# EAGLE design Main PCB (EAGLE 9.6.2)
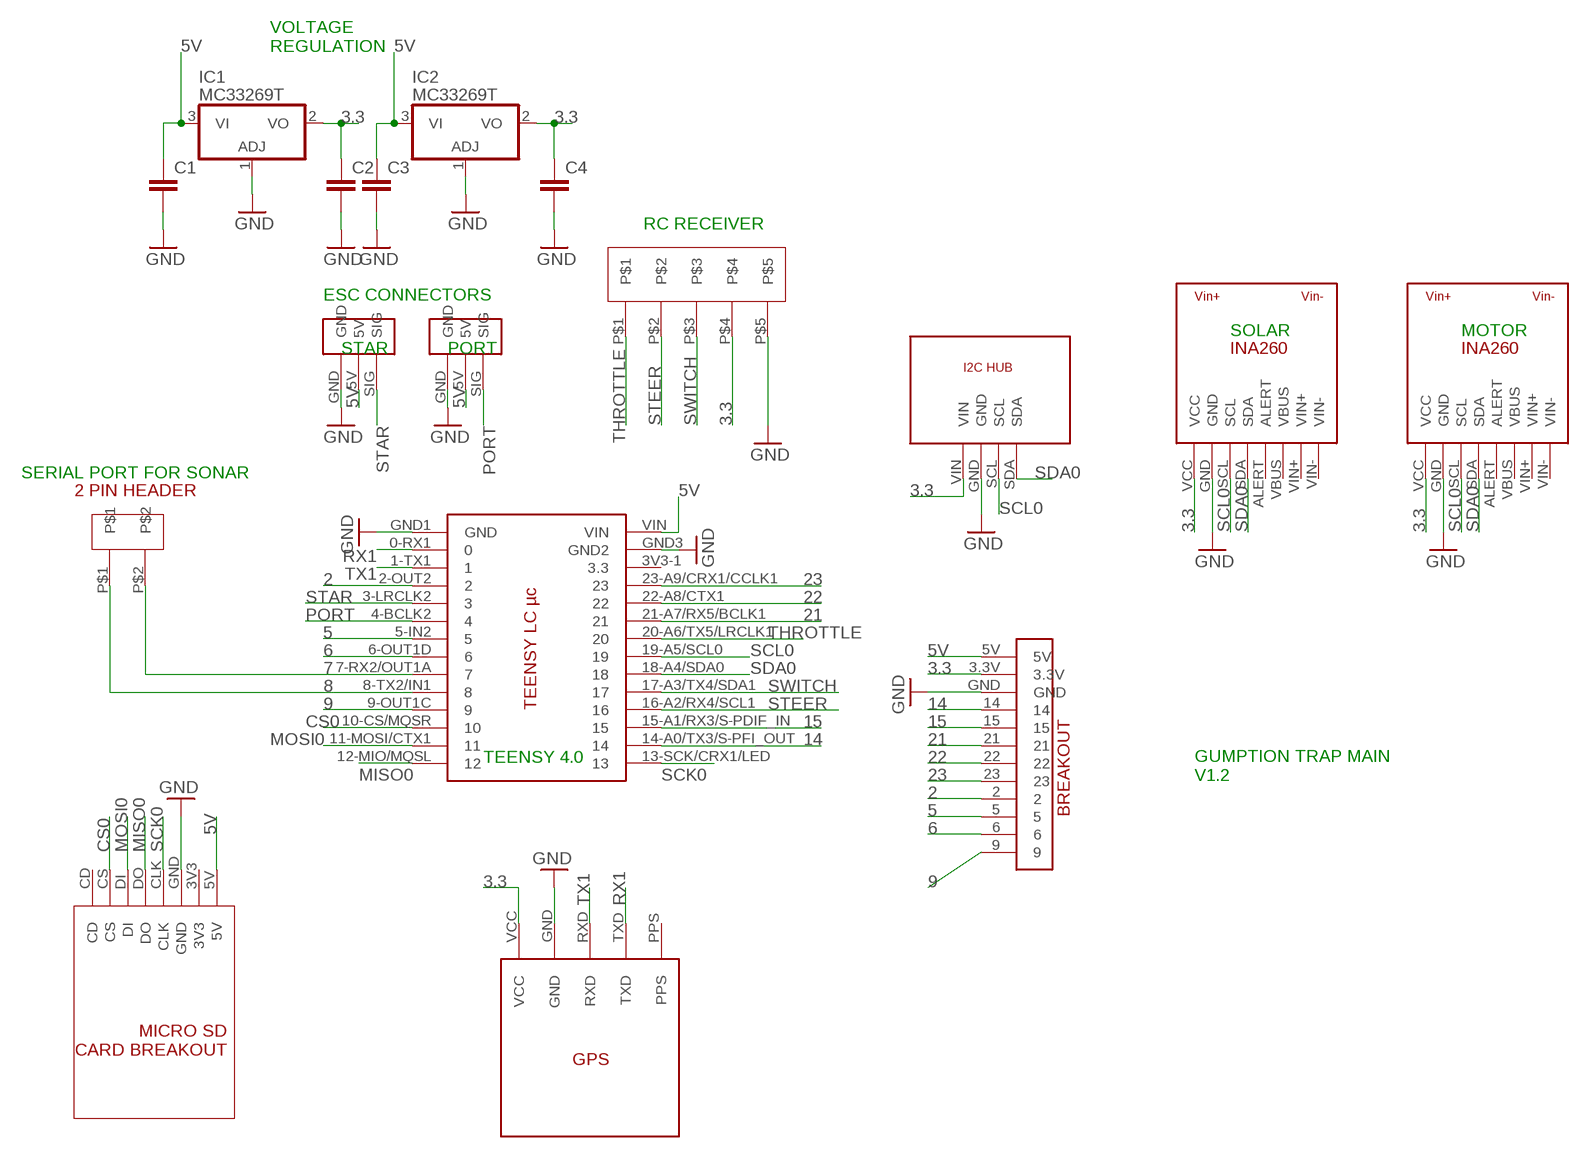
[diagram p0: schematic, sheet 1]

## Parts
C1  C2.5/2  [C2.5-2]
C2  C2.5/2  [C2.5-2]
C3  C2.5/2  [C2.5-2]
C4  C2.5/2  [C2.5-2]
IC1  MC33269T  [TO220V]
IC2  MC33269T  [TO220V]
MOTOR  INA260  [INA260]
PORT  SERVO3PIN  [SERVO3PIN]
SOLAR  INA260  [INA260]
STAR  SERVO3PIN  [SERVO3PIN]
U$1  TEENSYLC  [TEENSY40]
U$2  GPS  [GPS]
U$3  QT5HUB  [QT5HUB]
U$4  SD2  [SD2]
U$5  2PIN_JST-XH  [2PIN_JST-XH]
U$6  5PIN_JST-XH  [5PIN_JST-XH]
U$8  BREAKOUT  [BREAKOUT]

## Nets
2: U$1.2-OUT2 U$8.2
3.3: C2.1 C4.1 IC1.2(VO) IC2.2(VO) MOTOR.VCC SOLAR.VCC U$2.VCC U$3.VIN U$6.P$4 U$8.3.3V
5: U$1.5-IN2 U$8.5
5V: C1.1 C3.1 IC1.3(VI) IC2.3(VI) PORT.5V STAR.5V U$1.VIN U$4.5V U$8.5V
6: U$1.6-OUT1D U$8.6
7: U$1.7-RX2/OUT1A U$5.P$2
8: U$1.8-TX2/IN1 U$5.P$1
9: U$1.9-OUT1C U$8.9
14: U$1.14-A0/TX3/S-PFI_OUT U$8.14
15: U$1.15-A1/RX3/S-PDIF_IN U$8.15
21: U$1.21-A7/RX5/BCLK1 U$8.21
22: U$1.22-A8/CTX1 U$8.22
23: U$1.23-A9/CRX1/CCLK1 U$8.23
CS0: U$1.10-CS/MQSR U$4.CS
GND: C1.2 C2.2 C3.2 C4.2 IC1.1(ADJ) IC2.1(ADJ) MOTOR.GND PORT.GND SOLAR.GND STAR.GND U$1.GND1(GND) U$1.GND3(GND2) U$2.GND U$3.GND U$4.GND U$6.P$5 U$8.GND
MISO0: U$1.12-MIO/MQSL U$4.DO
MOSI0: U$1.11-MOSI/CTX1 U$4.DI
PORT: PORT.SIG U$1.4-BCLK2
RX1: U$1.0-RX1 U$2.TXD
SCK0: U$1.13-SCK/CRX1/LED U$4.CLK
SCL0: MOTOR.SCL SOLAR.SCL U$1.19-A5/SCL0 U$3.SCL
SDA0: MOTOR.SDA SOLAR.SDA U$1.18-A4/SDA0 U$3.SDA
STAR: STAR.SIG U$1.3-LRCLK2
STEER: U$1.16-A2/RX4/SCL1 U$6.P$2
SWITCH: U$1.17-A3/TX4/SDA1 U$6.P$3
THROTTLE: U$1.20-A6/TX5/LRCLK1 U$6.P$1
TX1: U$1.1-TX1 U$2.RXD
Unconnected: MOTOR.ALERT MOTOR.VBUS MOTOR.VIN+ MOTOR.VIN- SOLAR.ALERT SOLAR.VBUS SOLAR.VIN+ SOLAR.VIN- U$1.3V3-1(3.3) U$2.PPS U$4.3V3 U$4.CD

## Notes on the sheet
- VOLTAGE
  REGULATION
- RC RECEIVER
- ESC CONNECTORS
- SOLAR | MOTOR
- STAR | PORT
- SERIAL PORT FOR SONAR
- TEENSY 4.0
- GUMPTION TRAP MAIN
  V1.2

## Library data of the parts
C1-C4 = capacitor-wima:C: CAPACITOR naming: grid - package width
IC1 IC2 = linear:MC33269?*: Adjustable Output Low Dropout Voltage Regulator 800 mA Source: http://www.onsemi.com/pub/Collateral/MC33269-D.PDF
MOTOR SOLAR = GUMPTION TRAP:INA260
PORT STAR = GUMPTION TRAP:SERVO3PIN
U$1 = teensy:TEENSYLC
U$2 = HEXAPOD STUFF:GPS
U$3 = HEXAPOD STUFF:QT5HUB
U$4 = GUMPTION TRAP:SD2
U$5 = ROV:2PIN_JST-XH
U$6 = ROV:5PIN_JST-XH
U$8 = GUMPTION TRAP:BREAKOUT

## Board
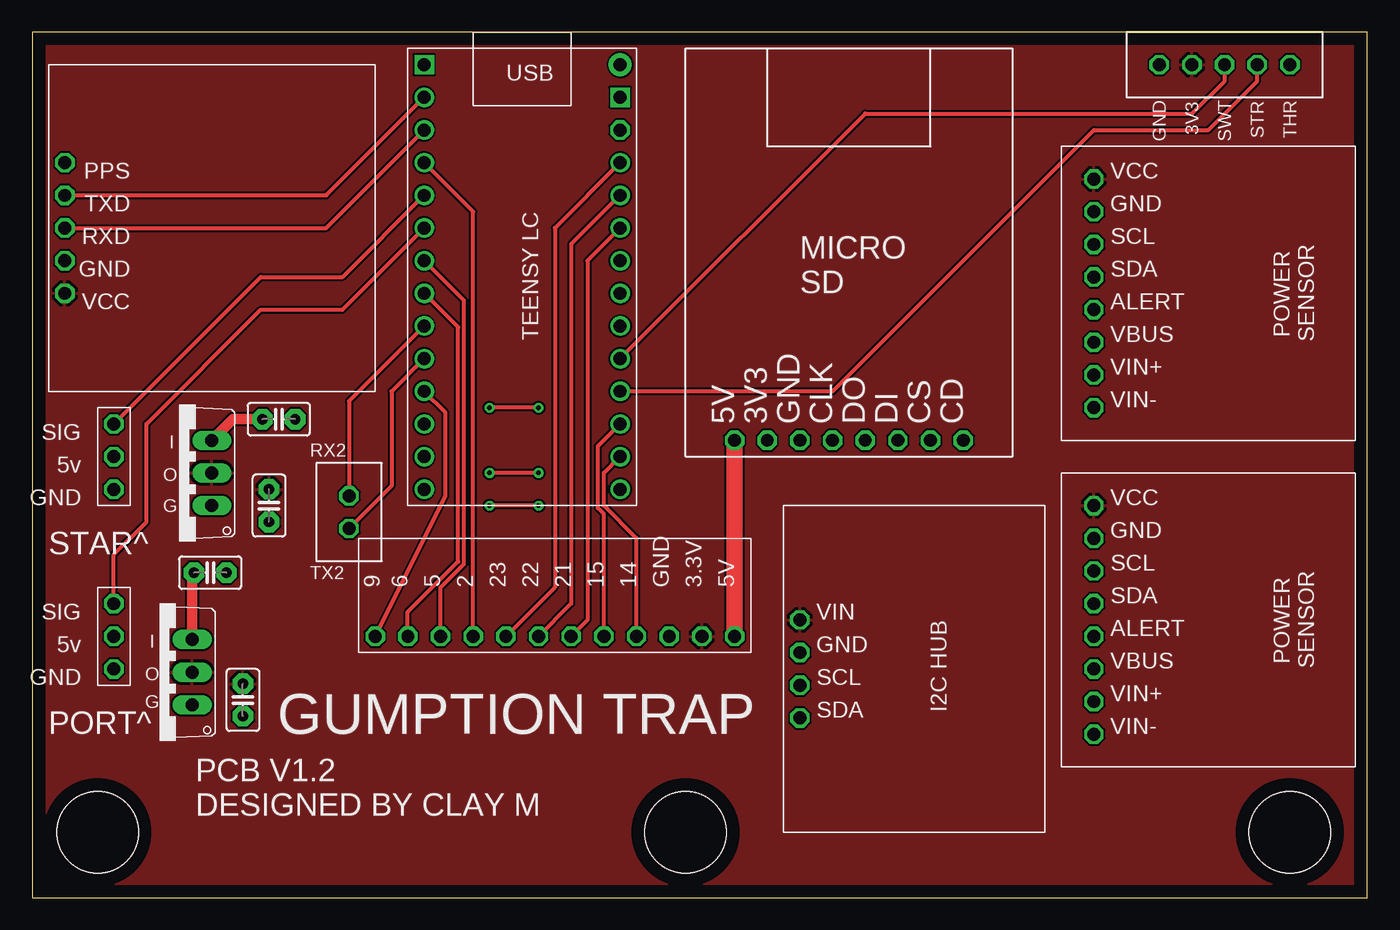
[diagram p1: board, top side]
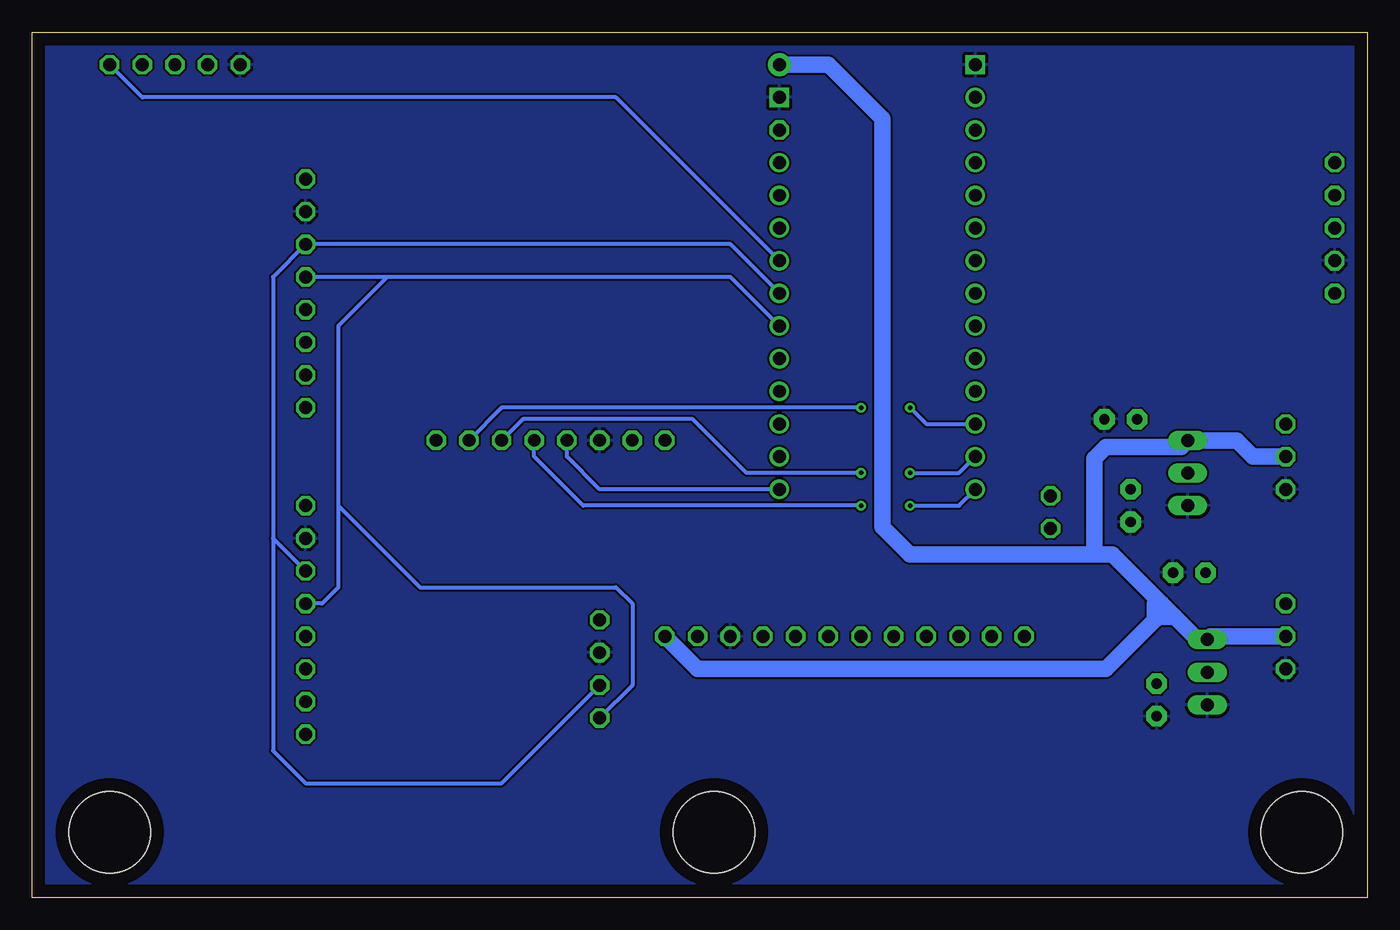
[diagram p2: board, bottom side, seen from below]

Size 103.81 x 67.3 mm. Coordinates in mm from the lower left corner, seen from the top.
Outline: 0,0 103.81,0 103.81,67.3 0,67.3 0,0
Copper layers (1*16): Top 0.035mm / dielectric 1.5mm / Bottom 0.035mm
Design rules "default": minimum track width 6mil, minimum drill 0.35mm, track to track 6mil, track to pad 6mil, pad to pad 6mil, via to via 6mil, smd to smd 6mil, copper to edge 40mil, drill to drill 6mil, minimum pad ring 10mil, minimum via ring 8mil, stop-mask expansion 4mil, vias tented up to drill 0mil, thermal gap 10mil
Holes 6.35 mm at 5.08,5.08 97.79,5.08 50.8,5.08

### Footprints (pad centres in the part's own frame; a part is rotated, then mirrored left to right if it is on the bottom)
C2.5-2 = drill 0.813 pad 1.6 octagon: 1 -1.27,0; 2 1.27,0
TO220V = drill 1.016 long: 1 -2.54,-2.54; 2 0,-2.54; 3 2.54,-2.54
INA260 = drill 1 octagon: ALERT 12.7,2.54; GND 5.08,2.54; SCL 7.62,2.54; SDA 10.16,2.54; VBUS 15.24,2.54; VCC 2.54,2.54; VIN+ 17.78,2.54; VIN- 20.32,2.54
SERVO3PIN = drill 1 octagon: 5V 3.81,1.27; GND 1.27,1.27; SIG 6.35,1.27
TEENSY40 = drill 1: 0-RX1 -13.97,-7.62; 1-TX1 -11.43,-7.62; 2-OUT2 -8.89,-7.62; 3-LRCLK2 -6.35,-7.62; 4-BCLK2 -3.81,-7.62; 5-IN2 -1.27,-7.62; 6-OUT1D 1.27,-7.62; 7-RX2/OUT1A 3.81,-7.62; 8-TX2/IN1 6.35,-7.62; 9-OUT1C 8.89,-7.62; 10-CS/MQSR 11.43,-7.62; 11-MOSI/CTX1 13.97,-7.62; 12-MIO/MQSL 16.51,-7.62; 13-SCK/CRX1/LED 16.51,7.62; 14-A0/TX3/S-PFI_OUT 13.97,7.62; 15-A1/RX3/S-PDIF_IN 11.43,7.62; 16-A2/RX4/SCL1 8.89,7.62; 17-A3/TX4/SDA1 6.35,7.62; 18-A4/SDA0 3.81,7.62; 19-A5/SCL0 1.27,7.62; 20-A6/TX5/LRCLK1 -1.27,7.62; 21-A7/RX5/BCLK1 -3.81,7.62; 22-A8/CTX1 -6.35,7.62; 23-A9/CRX1/CCLK1 -8.89,7.62 | drill 1 octagon: 3V3-1 -11.43,7.62 | drill 1 square: GND1 -16.51,-7.62; GND3 -13.97,7.62 | drill 1 pad 1.778: VIN -16.51,7.62
GPS = drill 1 octagon: GND 10.16,24.13; PPS 17.78,24.13; RXD 12.7,24.13; TXD 15.24,24.13; VCC 7.62,24.13
QT5HUB = drill 1 octagon: GND 11.43,-19.05; SCL 13.97,-19.05; SDA 16.51,-19.05; VIN 8.89,-19.05
SD2 = drill 1 octagon: 3V3 2.54,0; 5V 0,0; CD 17.78,0; CLK 7.62,0; CS 15.24,0; DI 12.7,0; DO 10.16,0; GND 5.08,0
2PIN_JST-XH = drill 1 octagon: P$1 0,0; P$2 2.54,0
5PIN_JST-XH = drill 1 octagon: P$1 0,0; P$2 2.54,0; P$3 5.08,0; P$4 7.62,0; P$5 10.16,0
BREAKOUT = drill 1 octagon: 2 1.27,22.86; 3.3V 1.27,5.08; 5 1.27,25.4; 5V 1.27,2.54; 6 1.27,27.94; 9 1.27,30.48; 14 1.27,10.16; 15 1.27,12.7; 21 1.27,15.24; 22 1.27,17.78; 23 1.27,20.32; GND 1.27,7.62

### Placement (x,y rotation side)
C1  19.18,37.21 0 top
C2  16.38,15.37 270 top
C3  13.84,25.27 0 top
C4  18.41,30.48 270 top
IC1  11.43,33.02 90 top
IC2  9.91,17.53 90 top
MOTOR  80.01,58.42 270 top
PORT  7.62,16.51 90 top
SOLAR  80.01,33.02 270 top
STAR  7.62,30.48 90 top
U$1  38.1,48.26 270 top
U$2  26.67,39.37 90 top
U$3  78.74,30.48 270 top
U$4  54.61,35.56 0 top
U$5  24.64,28.7 90 top
U$6  97.79,64.77 180 top
U$8  57.15,19.05 90 top

### Tracks (layer width: path | path; a pad name or v marks a point on that pad's centre or on a via)
2
  Top 0.305: U$8.2 34.29,53.34 U$1.2-OUT2
3.3
  pour Top: -1.27,68.58 -1.27,-2.54 107.95,-2.54 107.95,69.85 -1.27,69.85
5
  Top 0.305: U$8.5 31.75,24.11 33.58,25.94 33.58,46.43 U$1.5-IN2
5V
  Top 0.813: IC1.3 15.62,37.21 C1.1 | C3.1 12.45,25.02 IC2.3
  Top 1.27: U$8.5V U$4.5V
  Bottom 0.813: 16.51,21.59 15.24,21.59 14.99,21.84
  Bottom 1.27: STAR.5V 8.89,34.29 10.16,35.56 IC1.3 14.48,35.05 20.32,35.05 21.21,34.16 21.21,26.67 | 16,22.86 19.81,26.67 21.21,26.67 | 16,22.86 14.99,21.84 13.21,20.07 IC2.3 12.19,20.32 PORT.5V | U$8.5V 52.07,17.78 20.32,17.78 16.51,21.59 16.51,22.86 16,22.86 | U$1.VIN 41.91,64.77 37.72,60.58 37.72,28.83 35.56,26.67 21.21,26.67
6
  Top 0.305: U$8.6 29.21,22.21 33.12,26.13 33.12,44.35 U$1.6-OUT1D
7
  Top 0.305: U$1.7-RX2/OUT1A 24.64,38.61 U$5.P$2
8
  Top 0.305: U$1.8-TX2/IN1 27.94,39.37 27.94,32 U$5.P$1
9
  Top 0.305: U$8.9 32.13,31.24 32.13,37.72 U$1.9-OUT1C
14
  Top 0.305: U$8.14 46.99,27.94 44.45,30.48 44.45,33.02 U$1.14-A0/TX3/S-PFI_OUT
15
  Top 0.305: U$8.15 44.45,29.83 43.99,30.29 43.99,35.1 U$1.15-A1/RX3/S-PDIF_IN
21
  Top 0.305: U$8.21 43.18,21.59 43.18,49.53 U$1.21-A7/RX5/BCLK1
22
  Top 0.305: U$8.22 41.91,22.86 41.91,50.8 U$1.22-A8/CTX1
23
  Top 0.305: U$8.23 40.64,24.13 40.64,52.07 U$1.23-A9/CRX1/CCLK1
CS0  (via drill 0.35)
  Top 0.305: v39.37,38.1 v35.56,38.1
  Bottom 0.305: v35.56,38.1 34.29,36.83 U$1.10-CS/MQSR | U$4.CS 67.31,38.1 v39.37,38.1
GND
  pour Bottom: -1.27,68.58 -1.27,-2.54 107.95,-2.54 107.95,68.58
MISO0  (via drill 0.35)
  Top 0.305: v39.37,30.48 v35.56,30.48
  Bottom 0.305: v35.56,30.48 31.75,30.48 U$1.12-MIO/MQSL | U$4.DO 64.77,34.29 60.96,30.48 v39.37,30.48
MOSI0  (via drill 0.35)
  Top 0.305: v39.37,33.02 v35.56,33.02
  Bottom 0.305: v35.56,33.02 31.75,33.02 U$1.11-MOSI/CTX1 | v39.37,33.02 48.26,33.02 52.45,37.21 65.66,37.21 U$4.DI
PORT
  Top 0.305: PORT.SIG 6.35,26.67 8.89,29.21 8.89,36.83 17.78,45.72 24.13,45.72 U$1.4-BCLK2
RX1
  Top 0.305: U$2.TXD 22.86,54.61 U$1.0-RX1
SCK0
  Bottom 0.305: U$1.13-SCK/CRX1/LED 59.69,31.75 62.23,34.29 U$4.CLK
SCL0
  Bottom 0.305: U$1.19-A5/SCL0 49.53,50.8 MOTOR.SCL 85.09,48.26 85.09,27.94 | SOLAR.SCL 85.09,27.94 | 85.09,27.94 85.09,11.43 82.55,8.89 67.31,8.89 U$3.SCL
SDA0
  Bottom 0.305: U$1.18-A4/SDA0 49.53,48.26 76.2,48.26 | 76.2,48.26 MOTOR.SDA | 76.2,48.26 80.01,44.45 80.01,30.48 | 80.01,30.48 80.01,24.13 81.28,22.86 SOLAR.SDA | 80.01,30.48 73.66,24.13 58.42,24.13 57.15,22.86 57.15,16.51 U$3.SDA
STAR
  Top 0.305: STAR.SIG 17.78,48.26 24.13,48.26 U$1.3-LRCLK2
STEER
  Top 0.305: U$1.16-A2/RX4/SCL1 62.23,39.37 82.55,59.69 91.44,59.69 95.25,63.5 U$6.P$2
SWITCH
  Top 0.305: U$1.17-A3/TX4/SDA1 64.77,60.96 90.17,60.96 92.71,63.5 U$6.P$3
THROTTLE
  Bottom 0.305: U$1.20-A6/TX5/LRCLK1 58.42,62.23 95.25,62.23 U$6.P$1
TX1
  Top 0.305: U$2.RXD 22.86,52.07 U$1.1-TX1

### Text on the board
tNames: GND | 3V3 | SWT | STR | THR | I | RX2 | O | G | STAR^ | TX2 | I | O | G | PORT^ | GUMPTION TRAP | PCB V1.2 / DESIGNED BY CLAY M